# Altium schematic sheet n-MAX.SchDoc
size A3; DocumentNumber: 1; SheetNumber: 1; SheetTotal: 1; PageSetup: Record=PageOptions|CenterHorizontal=True|CenterVertical=True|PrintScale=0.97|XCorrection=1.00|YCorrection=1.00|PrintKind=2|BorderSize=5000000|LeftOffset=0|BottomOffset=0|Orientation=2|PaperLength=1000|PaperWidth=1000|Scale=100|PaperSource=7|PrintQuality=-4|MediaType=1|DitherType=10|PaperKind=A4|PrintScaleMode=1
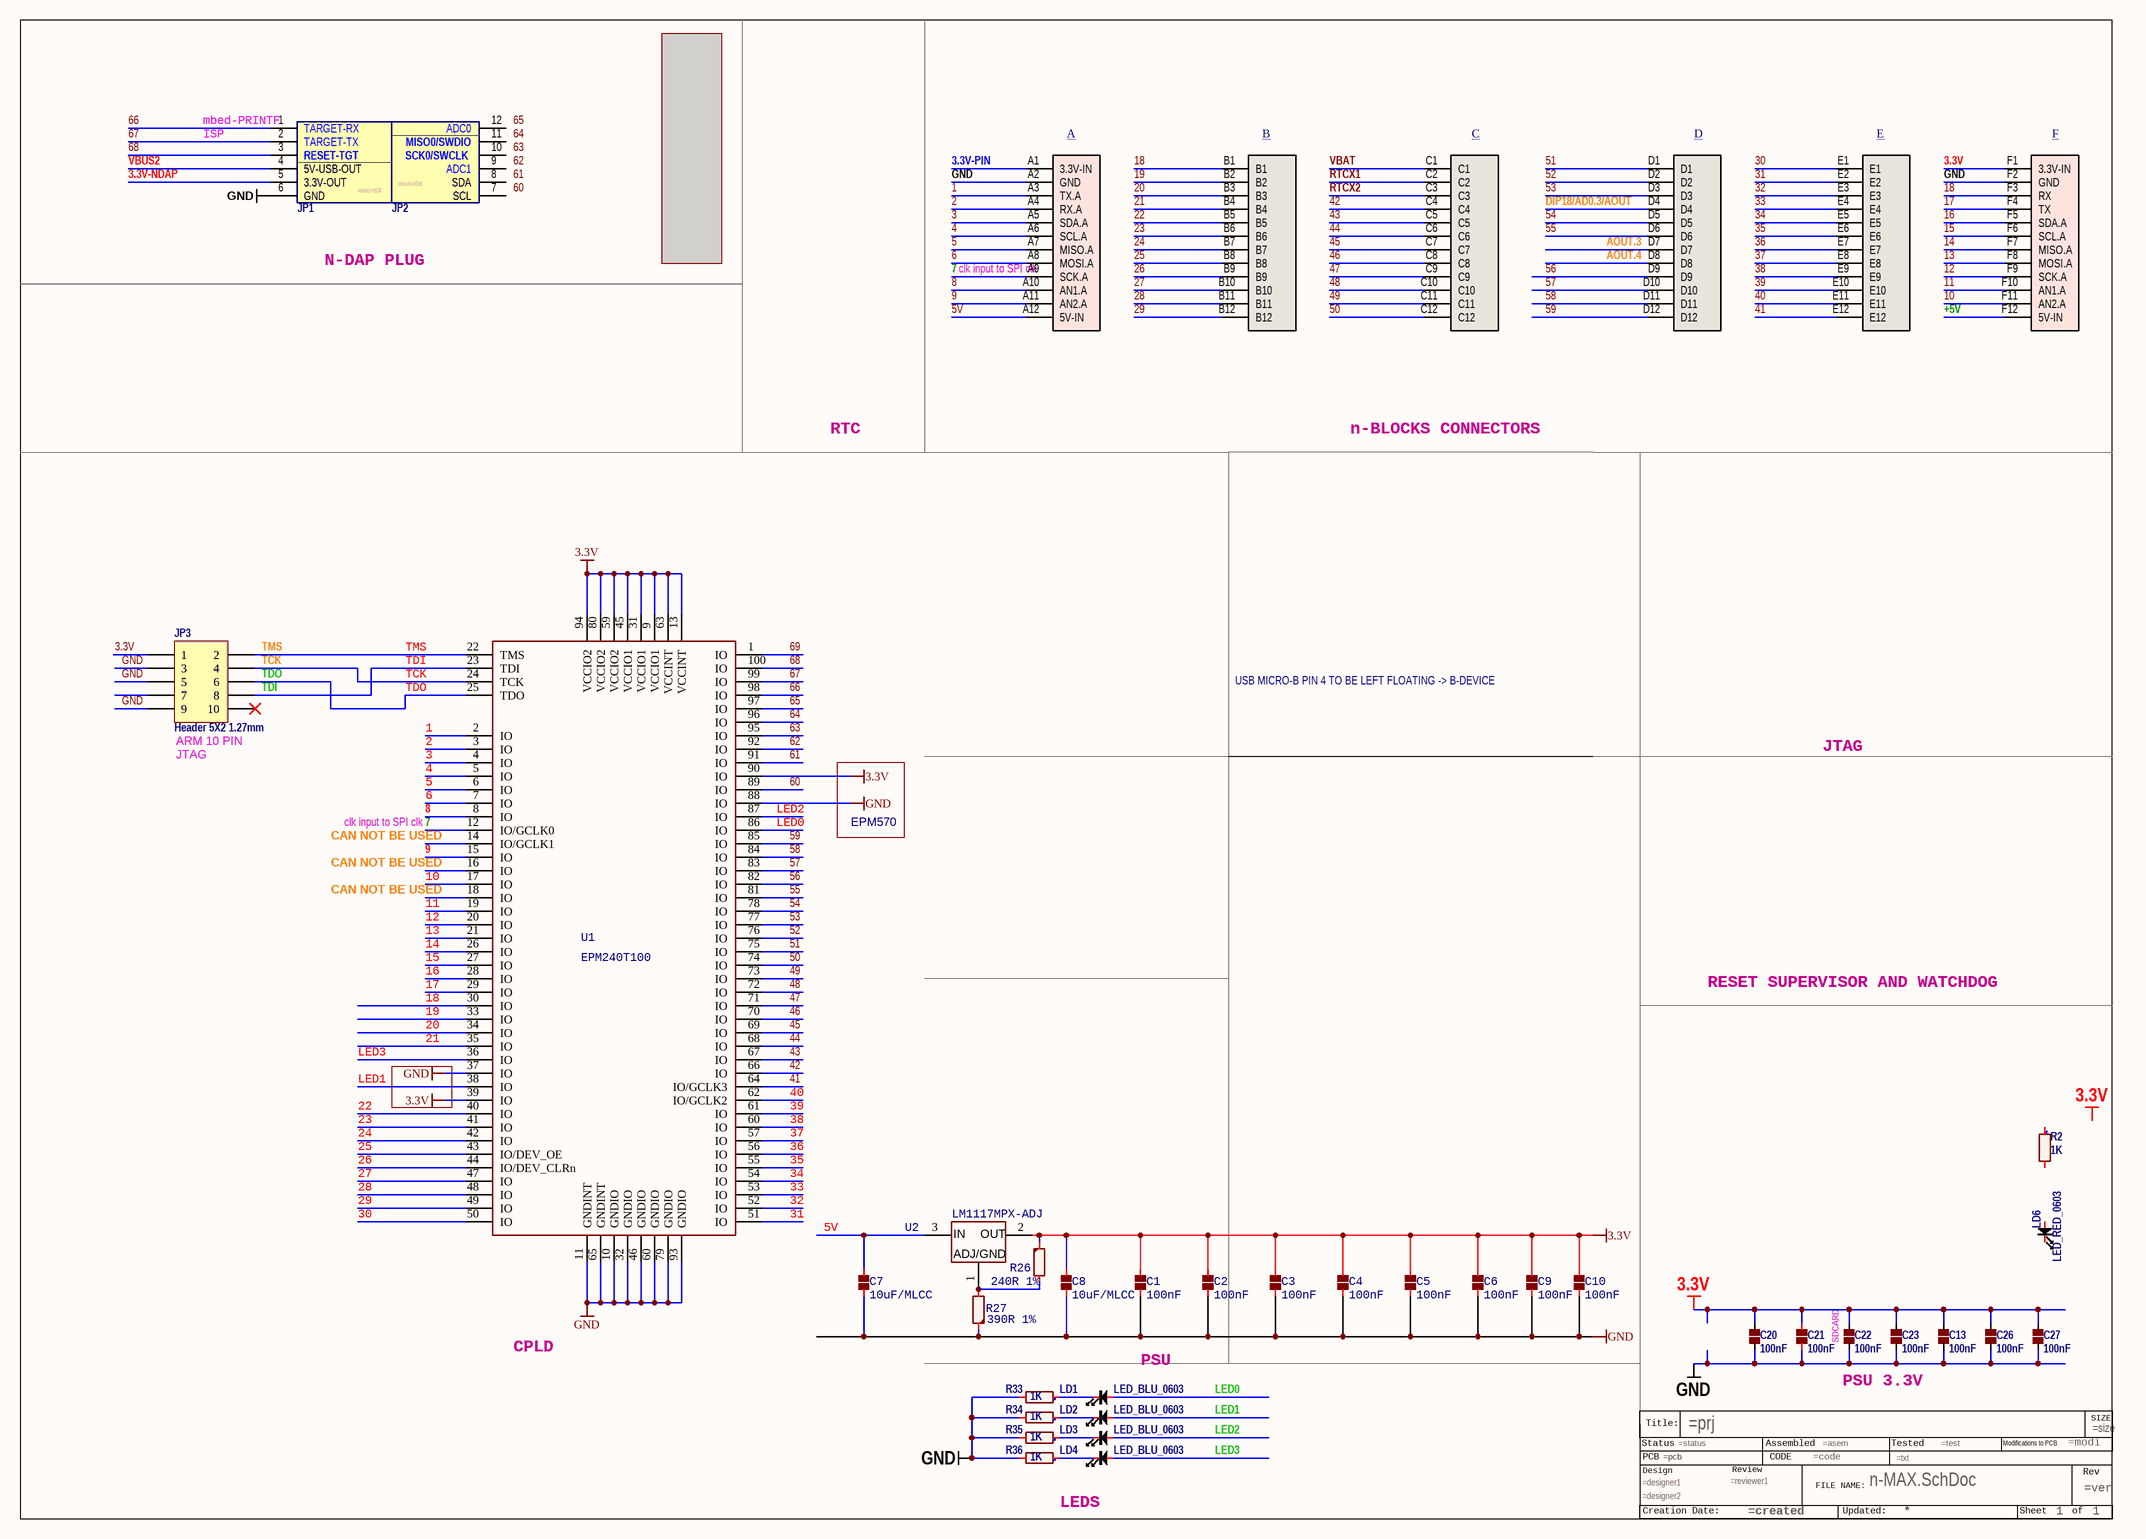
[diagram p0: n-MAX.SchDoc]

## Parts
?*??  FILE_NAME: n-MAX.SchDoc  PAGE NUMPER: 1  (hidden comment: TITLEBLOCK3)  (graphical)
B3  N-GMS-72PIN  [N-GMS-72PIN]  (value not drawn)  (parts A,B,C,D,E,F of 6)  (no BOM)
C1  100nF  [0603_CAP]
C2  100nF  [0603_CAP]
C3  100nF  [0603_CAP]
C4  100nF  [0603_CAP]
C5  100nF  [0603_CAP]
C6  100nF  [0603_CAP]
C7  10uF/MLCC  [0603_CAP]
C8  10uF/MLCC  [0603_CAP]
C9  100nF  [0603_CAP]
C10  100nF  [0603_CAP]
C13  100nF  [0603_CAP_SMALL]
C20  100nF  [0603_CAP_SMALL]
C21  100nF  [0603_CAP_SMALL]
C22  100nF  [0603_CAP_SMALL]
C23  100nF  [0603_CAP_SMALL]
C26  100nF  [0603_CAP_SMALL]
C27  100nF  [0603_CAP_SMALL]
JP1  N-DAP-LEFT  [N-DAP-LEFT]  (value not drawn)  (no BOM)
JP2  N-DAP-RIGHT  [N-DAP-RIGHT]  (value not drawn)  (no BOM)
JP3  Header 5X2 1.27mm  [2x5-1.27mm-HARWIN-855-M50-3600542]
LD1  LED_BLU_0603  [0603_LED_BLU]
LD2  LED_BLU_0603  [0603_LED_BLU]
LD3  LED_BLU_0603  [0603_LED_BLU]
LD4  LED_BLU_0603  [0603_LED_BLU]
LD6  LED_RED_0603  [0603_LED_RED]
R2  1K  [0603_RES_SMALL]
R26  240R 1%  [0603_RES]
R27  390R 1%  [0603_RES]
R33  1K  [0603_RES_SMALL]
R34  1K  [0603_RES_SMALL]
R35  1K  [0603_RES_SMALL]
R36  1K  [0603_RES_SMALL]
U1  EPM240T100  [TQFP100]
U2  LM1117MPX-ADJ  [SOT-223]

## Nets
3.3V: B3.F1(3.3V-IN) C1.1 C2.1 C3.1 C4.1 C5.1 C6.1 C8.1 C9.1 C10.1 C13.2 C20.2 C21.1 C22.2 C23.2 C26.2 C27.2 JP3.1 R26.1 U1.9(VCCIO1) U1.13(VCCINT) U1.31(VCCIO1) U1.39(IO) U1.45(VCCIO1) U1.59(VCCIO2) U1.63(VCCINT) U1.80(VCCIO2) U1.90(IO) U1.94(VCCIO2) U2.2(OUT)
GND: B3.A2(GND) B3.F2(GND) C1.2 C2.2 C3.2 C4.2 C5.2 C6.2 C7.2 C8.2 C9.2 C10.2 C13.1 C20.1 C21.2 C22.1 C23.1 C26.1 C27.1 JP1.6(GND) JP3.3 JP3.5 JP3.9 R27.1 R33.2 R34.2 R35.2 R36.2 U1.10(GNDIO) U1.11(GNDINT) U1.32(GNDIO) U1.37(IO) U1.46(GNDIO) U1.60(GNDIO) U1.65(GNDINT) U1.79(GNDIO) U1.88(IO) U1.93(GNDIO)
1: B3.A3(TX.A) U1.2(IO)
2: B3.A4(RX.A) U1.3(IO)
3: B3.A5(SDA.A) U1.4(IO)
3.3V-NDAP: JP1.5(3.3V-OUT)
3.3V-PIN: B3.A1(3.3V-IN)
4: B3.A6(SCL.A) U1.5(IO)
5: B3.A7(MISO.A) U1.6(IO)
5V: B3.A12(5V-IN) C7.1 U2.3(IN)
6: B3.A8(MOSI.A) U1.7(IO)
7: B3.A9(SCK.A) U1.12(IO/GCLK0)
8: B3.A10(AN1.A) U1.8(IO)
9: B3.A11(AN2.A) U1.15(IO)
10: B3.F11(AN2.A) U1.17(IO)
11: B3.F10(AN1.A) U1.19(IO)
12: B3.F9(SCK.A) U1.20(IO)
13: B3.F8(MOSI.A) U1.21(IO)
14: B3.F7(MISO.A) U1.26(IO)
15: B3.F6(SCL.A) U1.27(IO)
16: B3.F5(SDA.A) U1.28(IO)
17: B3.F4(TX) U1.29(IO)
18: B3.B1 B3.F3(RX) U1.30(IO)
19: B3.B2 U1.33(IO)
20: B3.B3 U1.34(IO)
21: B3.B4 U1.35(IO)
22: B3.B5 U1.40(IO)
23: B3.B6 U1.41(IO)
24: B3.B7 U1.42(IO)
25: B3.B8 U1.43(IO/DEV_OE)
26: B3.B9 U1.44(IO/DEV_CLRn)
27: B3.B10 U1.47(IO)
28: B3.B11 U1.48(IO)
29: B3.B12 U1.49(IO)
30: B3.E1 U1.50(IO)
31: B3.E2 U1.51(IO)
32: B3.E3 U1.52(IO)
33: B3.E4 U1.53(IO)
34: B3.E5 U1.54(IO)
35: B3.E6 U1.55(IO)
36: B3.E7 U1.56(IO)
37: B3.E8 U1.57(IO)
38: B3.E9 U1.60(IO)
39: B3.E10 U1.61(IO)
40: B3.E11 U1.62(IO/GCLK2)
41: B3.E12 U1.64(IO/GCLK3)
42: B3.C4 U1.66(IO)
43: B3.C5 U1.67(IO)
44: B3.C6 U1.68(IO)
45: B3.C7 U1.69(IO)
46: B3.C8 U1.70(IO)
47: B3.C9 U1.71(IO)
48: B3.C10 U1.72(IO)
49: B3.C11 U1.73(IO)
50: B3.C12 U1.74(IO)
51: B3.D1 U1.75(IO)
52: B3.D2 U1.76(IO)
53: B3.D3 U1.77(IO)
54: B3.D5 U1.78(IO)
55: B3.D6 U1.81(IO)
56: B3.D9 U1.82(IO)
57: B3.D10 U1.83(IO)
58: B3.D11 U1.84(IO)
59: B3.D12 U1.85(IO)
60: U1.89(IO)
61: U1.91(IO)
62: U1.92(IO)
63: U1.95(IO)
64: U1.96(IO)
65: U1.97(IO)
66: JP1.1(TARGET-RX) U1.98(IO)
67: JP1.2(TARGET-TX) U1.99(IO)
68: JP1.3(RESET-TGT) U1.100(IO)
69: U1.1(IO)
+5V: B3.F12(5V-IN)
AOUT.3: B3.D7
AOUT.4: B3.D8
DIP18/AD0.3/AOUT: B3.D4
LED0: LD1.1 U1.86(IO)
LED1: LD2.1 U1.38(IO)
LED2: LD3.1 U1.87(IO)
LED3: LD4.1 U1.36(IO)
RTCX1: B3.C2
RTCX2: B3.C3
TCK: JP3.4 U1.24(TCK)
TDI: JP3.8 U1.23(TDI)
TDO: JP3.6 U1.25(TDO)
TMS: JP3.2 U1.22(TMS)
VBAT: B3.C1
VBUS2: JP1.4(5V-USB-OUT)
NetLD1_2: LD1.2 R33.1
NetLD2_2: LD2.2 R34.1
NetLD3_2: LD3.2 R35.1
NetLD4_2: LD4.2 R36.1
NetR26_2: R26.2 R27.2 U2.1(ADJ/GND)

Not connected (* = marked no-connect by the designer): ?*?? ?1; JP2 7(SCL) 8(SDA) 9(ADC1) 10(SCK0/SWCLK) 11(MISO0/SWDIO) 12(ADC0); JP3 7 10*; LD6 1 2; R2 1 2; U1 14(IO/GCLK1) 16(IO) 18(IO)

## Notes on the sheet
- (near JP1) mbed-PRINTF
- ISP
- (near B3) A
- (near B3) B
- (near B3) C
- (near B3) D
- (near B3) E
- (near B3) F
- N-DAP PLUG
- (near B3) clk input to SPI clk
- RTC
- n-BLOCKS CONNECTORS
- USB MICRO-B PIN 4 TO BE LEFT FLOATING -> B-DEVICE
- (near JP3) ARM 10 PIN
- (near JP3) JTAG
- JTAG
- CAN NOT BE USED
- (near U1) clk input to SPI clk
- EPM570
- RESET SUPERVISOR AND WATCHDOG
- (near C22) SDCARD
- CPLD
- PSU
- PSU 3.3V
- LEDS
- Labels drawn without touching a wire or pin: 3.3V, 60, 61, 62, 63, 64, 65
- (in symbol N-DAP-LEFT) mbed-HDK
- (in symbol N-DAP-RIGHT) mbed-HDK
- (in symbol TITLEBLOCK3) SIZE; Title:; Status; Assembled; Tested; Modifications to PCB; PCB; CODE; Design; Review; Rev; FILE NAME:; Creation Date:; Updated:; Sheet; of

## Library data of the parts
C1-C6 C9 C10 = C: CAPACITOR; Manufacturer: Kemet; Manufacturer Part Number: C0603C104K5RACAUTO; S.Description: Multilayer Ceramic Capacitors MLCC - SMD/SMT 0.1uF 50volts 10% X7R AUTO; Capacitance: 0.1 uF; S.Footprint: 0603 (1608 metric); Tolerance: 10 %; Type: AEC-Q200; Voltage Rating DC: 50 VDC; Capacitance - pF: 100000 pF; Class: Class 1; Dielectric: X7R; Divider: 1; Supplier 1: Mouser; Supplier Part Number 1: 80-C0603C104K5RAUTO; RoHS: RoHS Compliant; Category: Multilayer Ceramic Capacitors MLCC - SMD/SMT; Stock 1: 388828; Pricing 1: 1=0.094, 10=0.033, 100=0.023, 500=0.019, 1000=0.015, 4000=0.011, 8000=0.009, 48000=0.007 (EUR); Height: -; Length: 1.6 mm; Packaging: Reel; Product: Automotive MLCCs; Series: C0603C; Termination Style: SMD/SMT; Voltage Rating AC: -; Width: 0.8 mm; Brand: Kemet; Capacitance - nF: 100 nF; Case Code - in: 0603; Case Code - mm: 1608; Maximum Operating Temperature: + 125 C; Minimum Operating Temperature: - 55 C; Qualification: AEC-Q200; Standard Pack Qty: 4000; RoHS - Mouser: Y; Minimum Order Quantity: 1; Reeling: True; ComponentLink1URL: http://www.mouser.com/ds/2/212/KEM_C1023_X7R_AUTO_SMD-519505.pdf; ComponentLink1Description: http://www.mouser.com/ds/2/212/KEM_C1023_X7R_AUTO_SMD-519505.pdf
C7 C8 = C: CAPACITOR; Manufacturer: Murata Electronics; Manufacturer Part Number: GRM188R60J106ME47D; S.Description: Multilayer Ceramic Capacitors MLCC - SMD/SMT 0603 10uF 6.3volts X5R 20%; Capacitance: 10 uF; S.Footprint: 0603 (1608 metric); Tolerance: 20 %; Type: General Purpose MLCC; Voltage Rating DC: 6.3 VDC; Dielectric: X5R; Qualification: Commercial; Divider: 1; Supplier 1: Mouser; Supplier Part Number 1: 81-GRM188R60J106ME47; RoHS: RoHS Compliant; Category: Multilayer Ceramic Capacitors MLCC - SMD/SMT; Stock 1: 1017745; Pricing 1: 1=0.141, 10=0.057, 100=0.040, 500=0.033, 1000=0.026, 4000=0.022 (EUR); Height: 0.8 mm; Length: 1.6 mm; Packaging: Reel; Product: General Type MLCCs; Series: GRM; Termination Style: SMD/SMT; Width: 0.8 mm; Brand: Murata Electronics; Case Code - in: 0603; Case Code - mm: 1608; Maximum Operating Temperature: + 85 C; Minimum Operating Temperature: - 55 C; Standard Pack Qty: 4000; RoHS - Mouser: Y; Minimum Order Quantity: 1; Reeling: True; ComponentLink1URL: http://www.mouser.com/ds/2/281/c02e-2905.pdf; ComponentLink1Description: http://www.mouser.com/ds/2/281/c02e-2905.pdf
C13 C20-C23 C26 C27 = C: CAPACITOR; CODE: 267-104; Divider: 1; S.Description: Multilayer Ceramic Capacitors MLCC - SMD/SMT 0603 0.1uF 16volts X7R 5%; S.Footprint: 0603 (1608 metric); Supplier 1: Mouser; Supplier Part Number 1: 77-VJ0603Y104JXJPBC
JP1 = N-DAP-LEFT: Divider: 1
JP2 = N-DAP-RIGHT: Divider: 1; S.Description: Headers & Wire Housings; Supplier 1: Mouser; Supplier Part Number 1: 437-8018300610012101
JP3 = Header 5X2: Header, 5-Pin, Dual row; S.Description: Headers & Wire Housings 5+5 DIL PIN HDR SMT Au/Sn; Divider: 1; Supplier 1: Mouser; Supplier Part Number 1: 855-M50-3600542
LD1-LD4 = LED: CODE: 621-200; Divider: 1; S.Description: Standard LEDs - SMD Blue 470nm 28mcd 5mA; S.Footprint: 0603; Supplier 1: Mouser; Supplier Part Number 1: 859-LTSTC193TBKT5A
LD6 = LED: CODE: 621-180; Divider: 1; S.Description: Standard LEDs - SMD Super Red, 633nm 180mcd, 20mA; S.Footprint: 0603 (1608 metric); Supplier 1: Mouser; Supplier Part Number 1: 720-LSQ976-NR-1
R2 R33-R36 = R: RESISTOR; CODE: 415-102; Divider: 1; S.Description: Thick Film Resistors - SMD 1K OHM 5%; S.Footprint: 0603 (1608 metric); Supplier 1: Mouser; Supplier Part Number 1: 603-RC0603JR-071KL
R26 = R: RESISTOR; Manufacturer: Panasonic; Manufacturer Part Number: ERJ-3EKF2400V; OLIMEX: OLIMEX#33 RES 0805 10 K 5%; S.Description: Thick Film Resistors - SMD 0603 240ohms 1% AEC-Q200; S.Footprint: 0603 (1608 metric); Power Rating: 100 mW; Resistance: 240 Ohms; Voltage Rating: 75 V; Qualification: AEC-Q200; Divider: 1; Supplier 1: Mouser; Supplier Part Number 1: 667-ERJ-3EKF2400V; RoHS: RoHS Compliant By Exemption; Category: Thick Film Resistors - SMD; Stock 1: 126186; Pricing 1: 1=0.141, 10=0.013, 100=0.006, 1000=0.004, 5000=0.002 (EUR); Height: 0.45 mm; Length: 1.6 mm; Operating Temperature Range: - 55 C to + 155 C; Packaging: Reel; Product: Thick Film Resistors SMD; Series: ERJ; Termination Style: SMD/SMT; Tolerance: 1 %; Type: Precision Thick Film Resistors SMD; Width: 0.8 mm; Brand: Panasonic; Case Code - in: 0603; Case Code - mm: 1608; Standard Pack Qty: 5000; RoHS - Mouser: E; Minimum Order Quantity: 1; Reeling: True; ComponentLink1URL: http://www.mouser.com/ds/2/315/AOA0000C86-911473.pdf; ComponentLink1Description: http://www.mouser.com/ds/2/315/AOA0000C86-911473.pdf
R27 = R: RESISTOR; Manufacturer: Vishay / Beyschlag; Manufacturer Part Number: MCT06030C3900FP500; S.Description: Thin Film Resistors - SMD .1W 390ohm 1% 0603 50ppm Auto; S.Footprint: 0603 (1608 metric); Power Rating: 100 mW; Resistance: 390 Ohms; Temperature Coefficient: 50 PPM / K; Voltage Rating: 75 V; Divider: 1; Supplier 1: Mouser; Supplier Part Number 1: 594-MCT06030C3900FP5; RoHS: RoHS Compliant; Category: Thin Film Resistors - SMD; Stock 1: 10472; Pricing 1: 1=0.094, 50=0.043, 100=0.033, 500=0.022, 5000=0.019 (EUR); Height: 0.45 mm; Length: 1.6 mm; Operating Temperature Range: - 55 C to + 125 C; Packaging: Reel; Product: Professional Resistors Thin Film SMD; Series: MCx - Professional; Termination Style: SMD/SMT; Tolerance: 1 %; Type: Professional Thin Film Chip Resistors; Width: 0.8 mm; Brand: Vishay / Beyschlag; Case Code - in: 0603; Case Code - mm: 1608; Standard Pack Qty: 5000; RoHS - Mouser: Y; Minimum Order Quantity: 1; Reeling: True; ComponentLink1URL: http://www.mouser.com/ds/2/427/mcx0x0xpro-223600.pdf; ComponentLink1Description: http://www.mouser.com/ds/2/427/mcx0x0xpro-223600.pdf
U1 = EPM240T100: Manufacturer: Altera; Manufacturer Part Number: EPM240T100C5N; S.Description: CPLD - Complex Programmable Logic Devices CPLD - MAX II 192 Macro 80 IOs; Memory Type: Flash; S.Footprint: TQFP-100; Number of I/Os: 80 I/O; Number of Macrocells: 192; Propagation Delay - Max: 4.7 ns; Maximum Operating Frequency: 304 MHz; Number of Logic Array Blocks - LABs: 24; Number of Logic Elements: 240; Operating Supply Current: 55 mA; Operating Supply Voltage: 2.5 V, 3.3 V; Supply Voltage - Max: 3.6 V; Supply Voltage - Min: 2.375 V; Total Memory: 8192 bit; Divider: 1; Supplier 1: Mouser; Supplier Part Number 1: 989-EPM240T100C5N; RoHS: RoHS Compliant; Category: CPLD - Complex Programmable Logic Devices; Stock 1: 589; Pricing 1: 1=7.07 (EUR); Packaging: Tray; Product: MAX II; Series: EPM240 MAX II; Brand: Altera; Mounting Style: SMD/SMT; Maximum Operating Temperature: + 70 C; Minimum Operating Temperature: 0 C; Standard Pack Qty: 90; Tradename: MAX II; RoHS - Mouser: Y; Minimum Order Quantity: 1; Reeling: False; ComponentLink1URL: http://www.mouser.com/ds/2/591/max2_mii5v1-472974.pdf; ComponentLink1Description: http://www.mouser.com/ds/2/591/max2_mii5v1-472974.pdf
U2 = LM1117: REGULATOR LOW DROPOUT; Manufacturer: Texas Instruments; Manufacturer Part Number: LM1117MP-ADJ/NOPB; S.Description: LDO Voltage Regulators 800MA LDO LINEAR REG; Input Voltage MAX: 15 V; Number of Outputs: 1 Output; Output Current: 1.5 A; Output Type: Adjustable; Output Voltage: 1.25 V to 13.8 V; S.Footprint: SOT-223-4; Dropout Voltage - Max: 1.2 V at 100 mA, 1.25 V at 500 mA, 1.3 V at 800 mA; Voltage Regulation Accuracy: +/- 1 %; Dropout Voltage: 1.1 V at 100 mA, 1.15 V at 500 mA, 1.2 V at 800 mA; Ib - Input Bias Current: 5 mA; Line Regulation: 0.04 %; Load Regulation: 0.2 %; Polarity: Positive; Reference Voltage: 1.262 V; Divider: 1; Supplier 1: Mouser; Supplier Part Number 1: 926-LM1117MP-ADJNOPB; RoHS: RoHS Compliant; Category: LDO Voltage Regulators; Stock 1: 2171; Pricing 1: 1=0.943, 10=0.805, 100=0.619, 500=0.547, 1000=0.432, 2000=0.381, 10000=0.374 (EUR); Packaging: Reel; Series: LM1117-N; Brand: Texas Instruments; Mounting Style: SMD/SMT; Maximum Operating Temperature: + 125 C; Minimum Operating Temperature: 0 C; Standard Pack Qty: 1000; RoHS - Mouser: Y; Minimum Order Quantity: 1; Reeling: True
?*?? = TITLEBLOCK3: size: =size; CREATION DATE: =created; UPDATED: *; PAGE COUNT: 1; VERSION: =ver; pr: =prj; ASSEMBLY: =asem; MODIFICATIONS TO OPERATE: =modi; TESTED: =test; PCB: =pcb; STATUS: =status; CODE: =code; TEXT: =txt; designer1: =designer1; designer2: =designer2; reviewer1: =reviewer1